# EAGLE design SimpleSAM (EAGLE 8.7.1)
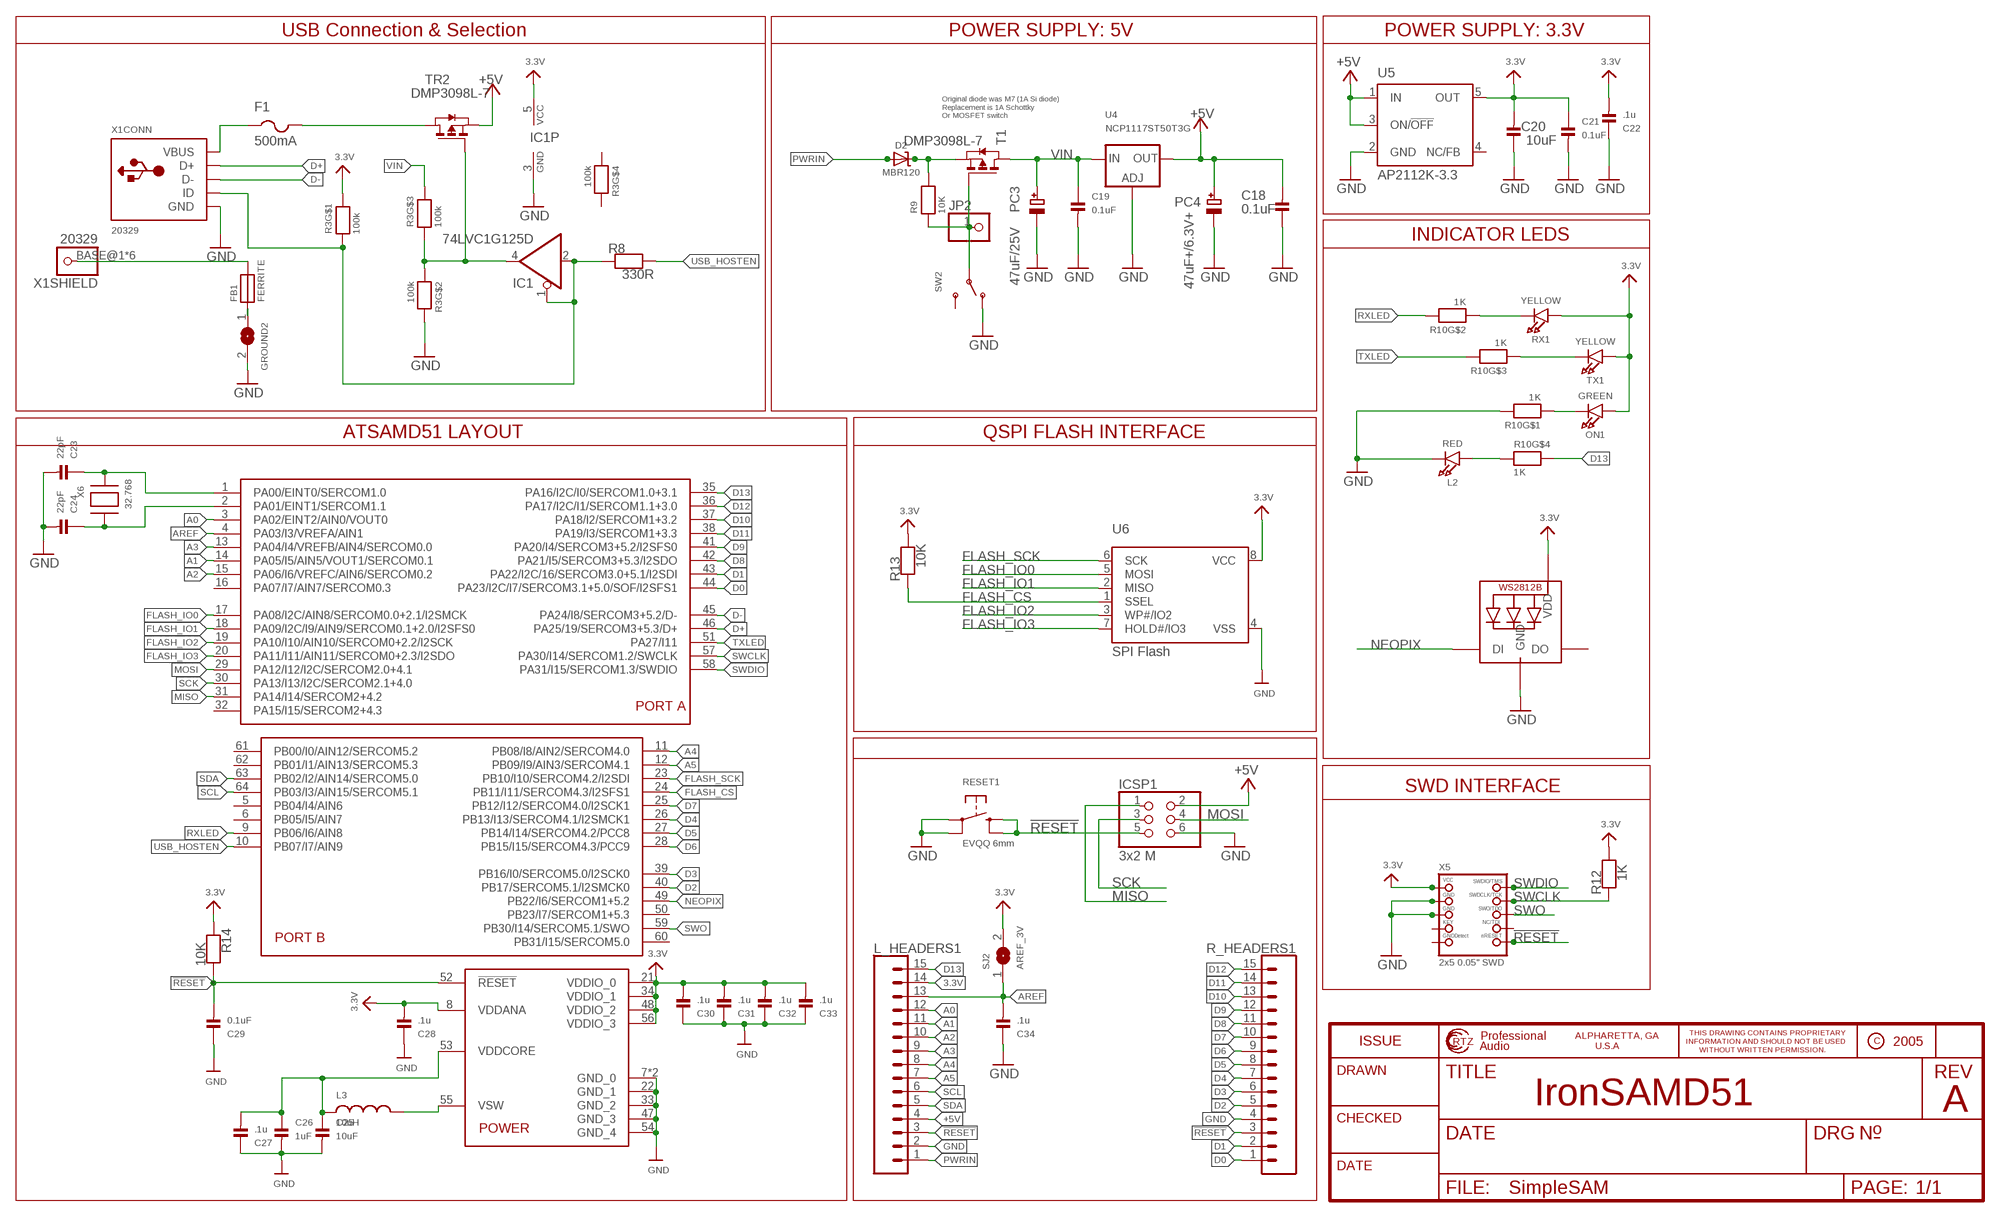
[diagram p0: schematic, sheet 1]

## Parts
C18  0.1uF  CAP_CERAMIC0805  [0805]
C19  0.1uF  CAP_CERAMIC0603  [0603]
C20  10uF  CAP_CERAMIC0805  [0805]
C21  0.1uF  CAP_CERAMIC0603  [0603]
C22  .1u  CAP_CERAMIC0603  [0603]
C23  22pF  CAP_CERAMIC0603  [0603]
C24  22pF  CAP_CERAMIC0603  [0603]
C25  10uF  CAP_CERAMIC0805  [0805]
C26  1uF  CAP_CERAMIC0603  [0603]
C27  .1u  CAP_CERAMIC0603  [0603]
C28  .1u  CAP_CERAMIC0603  [0603]
C29  0.1uF  CAP_CERAMIC0603  [0603]
C30  .1u  CAP_CERAMIC0603  [0603]
C31  .1u  CAP_CERAMIC0603  [0603]
C32  .1u  CAP_CERAMIC0603  [0603]
C33  .1u  CAP_CERAMIC0603  [0603]
C34  .1u  CAP_CERAMIC0603  [0603]
D2  MBR120  DIODE-SCHOTTKYSOD-123  [SOD-123]
F1  500mA  PTCFUSE-1206  [R1206]
FB1  FERRITE  [0603]
GROUND2  SOLDERJUMPERCLOSED  [SOLDERJUMPER_CLOSEDWIRE]
IC1  74LVC1G125D  74AHC1G125DBV  [SOT23-5]
ICSP1  3x2 M  HEADER-2X3  [2X03_ROUND_70MIL]
JP2  HEADER-1X1ROUND  [1X01_ROUND]
L2  RED  LED0805_NOOUTLINE  [CHIPLED_0805_NOOUTLINE]
L3  10uH  INDUCTOR  [INDUCTOR_1007]
L_HEADERS1  CONN_15  [1X15]
LED2  WS2812B3535  [LED3535]
ON1  GREEN  LED0805_NOOUTLINE  [CHIPLED_0805_NOOUTLINE]
PC3  47uF/25V  CAP_ELECTROLYTICPANASONIC_D  [PANASONIC_D]
PC4  47uF+/6.3V+  CAP_ELECTROLYTICPANASONIC_D  [PANASONIC_D]
R3  100k  RESISTOR_4PACK  [RESPACK_4X0603]
R8  330R  RESISTOR0603  [0603]
R9  10K  RESISTOR0603  [0603]
R10  1K  RESISTOR_4PACK  [RESPACK_4X0603]
R12  1K  RESISTOR0603  [0603]
R13  10K  RESISTOR0603  [0603]
R14  10K  RESISTOR0603  [0603]
R_HEADERS1  CONN_15  [1X15]
RESET1  EVQQ 6mm  SWITCH_TACT_SMT  [EVQ-Q2]
RX1  YELLOW  LED0805_NOOUTLINE  [CHIPLED_0805_NOOUTLINE]
SJ2  AREF_3V  SOLDERJUMPERCLOSED  [SOLDERJUMPER_CLOSEDWIRE]
SW2  SWITCH_SPDT  [SPDT_SMT_SSSS811101]
T1  DMP3098L-7  PMOSSOT23  [SOT-23]
TR2  DMP3098L-7  0297_PMV48XP  [SOT-23]
TX1  YELLOW  LED0805_NOOUTLINE  [CHIPLED_0805_NOOUTLINE]
U4  NCP1117ST50T3G  LM1117SOT223-REFLOW  [SOT223-R]
U5  AP2112K-3.3  LP2985-XXDBVR33  [SOT23-DBV]
U6  SPI Flash  SPIFLASH_SOIC8208MIL  [SOIC8_208MIL]
U$32  ATSAMD51J  [PQFN64-1]
X1  20329  USB_W_SHIELD_V2  [4UCONN_20329_V2]
X5  2x5 0.05" SWD  JTAG-CORTEXBOXPOSTS  [2X05_1.27MM_BOX_POSTS]
X6  32.768  XTAL-3.2X1.5  [XTAL3215]

## Nets
3.3V: C20.2 C21.1 C22.2 C28.2 C30.2 C31.2 C32.2 C33.2 IC1.5(VCC) L_HEADERS1.14 LED2.2(VDD) ON1.A R3.8 R14.1 RX1.A SJ2.2 TX1.A U5.5(OUT) U6.8(VCC) U$32.8(VDDANA) U$32.21(VDDIO_0) U$32.34(VDDIO_1) U$32.48(VDDIO_2) U$32.56(VDDIO_3) X5.1(VCC)
!RESET: C29.2 ICSP1.5 L_HEADERS1.3 R14.2 R_HEADERS1.3 RESET1.B'(S1) RESET1.B(S) U$32.52(!RESET) X5.10(NRESET)
+5V [usbvcc]: C18.2 ICSP1.2 L_HEADERS1.4 PC4.+ TR2.2(S) U4.2(OUT) U4.4(OUT) U5.1(IN) U5.3(ON/!OFF)
A0: L_HEADERS1.12 U$32.3(PA02/EINT2/AIN0/VOUT0)
A1: L_HEADERS1.11 U$32.14(PA05/I5/AIN5/VOUT1/SERCOM0.1)
A2: L_HEADERS1.10 U$32.15(PA06/I6/VREFC/AIN6/SERCOM0.2)
A3: L_HEADERS1.9 U$32.13(PA04/I4/VREFB/AIN4/SERCOM0.0)
A4: L_HEADERS1.8 U$32.11(PB08/I8/AIN2/SERCOM4.0)
A5: L_HEADERS1.7 U$32.12(PB09/I9/AIN3/SERCOM4.1)
AREF: C34.2 L_HEADERS1.13 SJ2.1 U$32.4(PA03/I3/VREFA/AIN1)
D0: R_HEADERS1.1 U$32.44(PA23/I2C/I7/SERCOM3.1+5.0/SOF/I2SFS1)
D1: R_HEADERS1.2 U$32.43(PA22/I2C/16/SERCOM3.0+5.1/I2SDI)
D2: R_HEADERS1.5 U$32.40(PB17/SERCOM5.1/I2SMCK0)
D3: R_HEADERS1.6 U$32.39(PB16/I0/SERCOM5.0/I2SCK0)
D4: R_HEADERS1.7 U$32.26(PB13/I13/SERCOM4.1/I2SMCK1)
D5: R_HEADERS1.8 U$32.27(PB14/I14/SERCOM4.2/PCC8)
D6: R_HEADERS1.9 U$32.28(PB15/I15/SERCOM4.3/PCC9)
D7: R_HEADERS1.10 U$32.25(PB12/I12/SERCOM4.0/I2SCK1)
D8: R_HEADERS1.11 U$32.42(PA21/I5/SERCOM3+5.3/I2SDO)
D9: R_HEADERS1.12 U$32.41(PA20/I4/SERCOM3+5.2/I2SFS0)
D10: R_HEADERS1.13 U$32.37(PA18/I2/SERCOM1+3.2)
D11: R_HEADERS1.14 U$32.38(PA19/I3/SERCOM1+3.3)
D12: R_HEADERS1.15 U$32.36(PA17/I2C/I1/SERCOM1.1+3.0)
D13: L_HEADERS1.15 R10.5 U$32.35(PA16/I2C/I0/SERCOM1.0+3.1)
D+: U$32.46(PA25/19/SERCOM3+5.3/D+) X1.D+(CONN:D+)
D-: U$32.45(PA24/I8/SERCOM3+5.2/D-) X1.D-(CONN:D-)
FLASH_CS: R13.1 U6.1(SSEL) U$32.24(PB11/I11/SERCOM4.3/I2SFS1)
FLASH_IO0: U6.5(MOSI) U$32.17(PA08/I2C/AIN8/SERCOM0.0+2.1/I2SMCK)
FLASH_IO1: U6.2(MISO) U$32.18(PA09/I2C/I9/AIN9/SERCOM0.1+2.0/I2SFS0)
FLASH_IO2: U6.3(WP#/IO2) U$32.19(PA10/I10/AIN10/SERCOM0+2.2/I2SCK)
FLASH_IO3: U6.7(HOLD#/IO3) U$32.20(PA11/I11/AIN11/SERCOM0+2.3/I2SDO)
FLASH_SCK: U6.6(SCK) U$32.23(PB10/I10/SERCOM4.2/I2SDI)
GND: C18.1 C19.2 C20.1 C21.2 C22.1 C23.2 C24.2 C25.2 C26.2 C27.1 C29.1 C30.1 C31.1 C32.1 C33.1 C34.1 GROUND2.2 IC1.3(GND) ICSP1.6 L2.C L_HEADERS1.2 LED2.4(GND) PC3.- PC4.- R3.7 R10.8 R_HEADERS1.4 RESET1.A'(P1) RESET1.A(P) SW2.A(O) U4.1(ADJ) U5.2(GND) U6.4(VSS) U$32.7(GND_0) U$32.22(GND_1) U$32.33(GND_2) U$32.47(GND_3) U$32.54(GND_4) U$32.EXP(GND_0) X1.GND(CONN:GND) X5.3(GND) X5.5(GND)
MISO: ICSP1.1 U$32.31(PA14/I14/SERCOM2+4.2)
MOSI: ICSP1.4 U$32.29(PA12/I12/I2C/SERCOM2.0+4.1)
N$2: F1.1 X1.VBUS(CONN:VBUS)
N$16: F1.2 TR2.1(D)
N$17: IC1.4(O) R3.2 R3.3 TR2.3(G)
N$18: FB1.1 GROUND2.1
N$19: D2.C R9.2 T1.2(S)
N$20: R10.2 RX1.C
N$21: R10.3 TX1.C
N$22: L2.A R10.4
N$23: C23.1 U$32.1(PA00/EINT0/SERCOM1.0) X6.P$1
N$24: C24.1 U$32.2(PA01/EINT1/SERCOM1.1) X6.P$2
N$25: L3.P$2 U$32.55(VSW)
N$26: C25.1 C26.1 C27.2 L3.P$1 U$32.53(VDDCORE)
N$27: ON1.C R10.1
N$28: IC1.1(OE) IC1.2(I) R3.1 R8.1 X1.ID(CONN:ID)
NEOPIX: LED2.1(DI) U$32.49(PB22/I6/SERCOM1+5.2)
PWR_SWITCH1: JP2.1 R9.1 SW2.B(P) T1.3(G)
PWRIN [USB]: D2.A L_HEADERS1.1
RXLED: R10.7 U$32.9(PB06/I6/AIN8)
SCK: ICSP1.3 U$32.30(PA13/I13/I2C/SERCOM2.1+4.0)
SCL: L_HEADERS1.6 U$32.64(PB03/I3/AIN15/SERCOM5.1)
SDA: L_HEADERS1.5 U$32.63(PB02/I2/AIN14/SERCOM5.0)
SWCLK: R12.1 U$32.57(PA30/I14/SERCOM1.2/SWCLK) X5.4(SWDCLK)
SWDIO: U$32.58(PA31/I15/SERCOM1.3/SWDIO) X5.2(SWDIO)
SWO: U$32.59(PB30/I14/SERCOM5.1/SWO) X5.6(SWO)
TXLED: R10.6 U$32.51(PA27/I11)
USB_HOSTEN: R8.2 U$32.10(PB07/I7/AIN9)
USHIELD1 [gnd]: FB1.2 X1.BASE@1 X1.BASE@2 X1.SPRT@1 X1.SPRT@2 X1.SPRT@3 X1.SPRT@4
VIN: C19.1 PC3.+ R3.6 T1.1(D) U4.3(IN)
Unconnected: C28.1 LED2.3(DO) R3.4 R3.5 R12.2 R13.2 SW2.C(S) U5.4(NC/FB) U$32.5(PB04/I4/AIN6) U$32.6(PB05/I5/AIN7) U$32.16(PA07/I7/AIN7/SERCOM0.3) U$32.32(PA15/I15/SERCOM2+4.3) U$32.50(PB23/I7/SERCOM1+5.3) U$32.60(PB31/I15/SERCOM5.0) U$32.61(PB00/I0/AIN12/SERCOM5.2) U$32.62(PB01/I1/AIN13/SERCOM5.3) X5.7(KEY) X5.8(TDI) X5.9(GNDDETECT)

## Notes on the sheet
- USB Connection & Selection | POWER SUPPLY: 5V | POWER SUPPLY: 3.3V
- Original diode was M7 (1A Si diode)
  Replacement is 1A Schottky
  Or MOSFET switch
- INDICATOR LEDS
- ATSAMD51 LAYOUT | QSPI FLASH INTERFACE
- SWD INTERFACE
- IronSAMD51 | A

## Library data of the parts
C18-C34 = microbuilder:CAP_CERAMIC: Ceramic Capacitors 0402 - 0402 Surface Mount Capacitors 16pF 50V 5% [Digikey: 445-4899-2-ND] 18pF 50V 5% [Digikey: 490-1281-2-ND] 22pF 50V 5% [Digikey: 490-1283-2-ND] 68pF 50V 5% [Digikey: 490-1289-2-ND] 0.1uF 10V 10% [Digikey: 490-1318-2-ND] 1.0uF 6.3V 10% [Digikey: 490-1320-2-ND] 0603 - 0603 Surface Mount Capacitors 16 pF 50V 5% [Digikey: 445-5051-2-ND] 22 pF 50V [Digikey: PCC220ACVTR-ND] 33 pF 50V 5% [Digikey: 490-1415-1-ND] 56pF 50V 5% [Digikey: 490-1421-1-ND] 220pF 50V 5% [Digikey: 445-1285-1-ND] 680 pF 50V 2200 pF 50V 5% C0G [Digikey: 445-1297-1-ND] 5600 pF 100V 5% X7R [Digikey: 478-3711-1-ND] 0.1 µF 25V 10% [Digikey: PCC2277TR-ND] 0.22 µF 16V 10% X7R [Digikey: 445-1318-1-ND] 1.0 µF 25V 10% [Digikey: 445-5146-2-ND] 0603 - RF Specific 3pF 250V +/-0.1pF RF [Digikey: 712-1347-1-ND] 18 pF 250V 5% [Digikey: 478-3505-1-ND or 712-1322-1-ND] 56 pF 250V 5% C0G RF [Digikey: 490-4867-1-ND] 68 pF 250V RF [Digikey: 490-4868-1-ND] 0805 - 0805 Surface Mount Capacitors 220 pF 250V 2% RF Ceramic Capacitor [Digikey: 712-1398-1-ND] 1000 pF 50V 2% NP0 Ceramic Capacitor [Digikey: 478-3760-1-ND] 0.1 µF 25V 10% Ceramic Capacitor [Digikey: PCC1828TR-ND] 1.0 µF 16V 10% Ceramic Capacitor[Digikey: 490-1691-2-ND] 10.0 µF 10V 10% Ceramic Capacitor[Digikey: 709-1228-1-ND] 10.0 uF 16V 10% Ceramic Capacitor [Digikey: 478-5165-2-ND] 47 uF 6.3V 20% Ceramic Capacitor [Digikey: 587-1779-1-ND or 399-5506-1-ND] 1206 - 1206 Surface Mount Capacitors 47uF 10V 20% Ceramic Capacitor [Digikey: 490-5528-1-ND or 399-5508-1-ND or 445-6010-1-ND]
D2 = microbuilder:DIODE-SCHOTTKY
F1 = adafruit:PTCFUSE: PTC fuses, resettable thermistors
FB1 = microbuilder:FERRITE: Ferrite Bead 0603 MMZ1608B121C - 120 Ohm, 600mA Ferrite Chip - Digikey: 445-2164-1-ND BK1608HW121-T - 120 Ohm, 600mA Ferrite Chip - Digikey: 587-1876-2-ND
GROUND2 SJ2 = microbuilder:SOLDERJUMPER: SMD Solder JUMPER Solder the two pads together to create a connection, or remove the solder to break it. REFLOW - Use this footprint for solder paste and reflow ovens. WAVE - Use this footprint for hand-soldering (larger pads). CLOSED - Has a trace between the two pads to ensure it is closed by default. The trace needs to be cut to disable the jumper, and can be closed again by creating a solder bridge between the two pads.
IC1 = 74xx-little-de:74*1G125: Single Bus Buffer Gate with 3-State Output
ICSP1 = microbuilder:HEADER-2X3: PIN HEADER
JP2 = microbuilder:HEADER-1X1: PIN HEADER
L2 ON1 RX1 TX1 = microbuilder:LED: LED 0603 - 0603 Surface Mount Package 2mA: Green LED - Low Power (3.9mcd, 2ma, 1.7Vf) - Digikey: 475-2709-2-ND Orange LED - Low Power (9.8mcd, 2ma, 1.8Vf) - Digikey: 475-1194-2-ND Red LED - Low Power (5mcd, 2ma, 1.8Vf) - Digikey: 475-1195-2-ND Yellow LED - Low Power (7mcd, 2ma, 1.8Vf) - Digikey: 475-1196-2-ND 5mA: Blue LED - Low Power (17mcd, 5ma, 2.9Vf) - Digikey: LNJ937W8CRACT-ND 0805 - 0805 Surface Mount Package 2mA: Red LED (8.8mcd, 2mA, 1.8Vf, Clear) - Low Power [Digikey: 475-2510-1-ND] Green LED (5mcd, 2mA, 1.8Vf, Clear) - Low Power [Digikey: 475-2730-1-ND] Yellow LED (11.3mcd, 2mA, 1.8Vf, Clear) - Low Power [Digikey: 475-2555-1-ND] 20mA: Red LED (104mcd, 20mA, Diffused) - LS R976 [Digikey: 475-1278-6-ND] Red LED (12mcd, 20mA, 2.0Vf, Clear) - APT2012EC [Digikey: 754-1128-1-ND] Green LED (15mcd, 20mA, 2.2Vf, Clear) - APT2012GC [Digikey: 754-1131-1-ND] Orange LED (160mcd, 20mA, 2.1Vf, Clear) - APT2012SECK [Digikey: 754-1130-1-ND] 1206 - 1206 Surface Mount Package Green LED (26mcd, 20mA, Diffused) - LG N971 [Digikey: 475-1407-6-ND] Red LED (15mcd, 20mA, Diffused) - LH N974 [Digikey: 475-1416-6-ND] Cree - Cree High-Power Surface Mount LEDs XPEBWT-L1-0000-00D50 - White 111lm 350mA 2.9Vf 6200K 110° XTEAWT-00-0000-00000LEE3 - White 114lm 350mA 2.85Vf 5000K 115° Everlight - Everlight 45-21 Series Surface Mount LEDs 45-21/QK2C-B2832AC2CB2/2T - Warm White 2000mcd 20mA 3.25Vf 3050K 120° 45-21/LK2C-B38452C4CB2/2T - Nuetral White 2000mcd 20mA 3.25Vf 4150K 120° 45-21/LK2C-B50634C6CB2/2T - Cold White 2200mcd 20mA 3.25Vf 5650K 120° PLCC2 Reverse Mount LS T77K-J1L2-1-0-2-R18-Z - Red 11.25mcd 2mA 1.8Vf 630nm 120° LO T77K-L1M2-24-Z - Orange 19.6mcd 2mA 1.8Vf 606nm 120° LY T77K-K2M1-26-Z - Yellow 15.7mcd 2mA 1.8Vf 587nm 120°
L3 = microbuilder:INDUCTOR: Inductors 0603: 10nH Ceramic Inductor - microwire antenna/RF (Digikey: 712-1434-2-ND) 0805: 560nH Ceramic Inductor - RF (Digikey: 553-1047-1-ND) 1007 (2518 Metric) SMT: 10µH 10% 250mOhm 820mA 1007 Inductor (Digikey: 587-2189-1-ND) 22µH 10% 500mOhm 580mA 1007 Inductor (Digikey: 587-2190-1-ND) 47µH 10% 950mOhm 420mA 1007 Inductor (Digikey: 587-2191-1-ND) 47µH 5% 100mOhm 1A 1008 Inductor (Digikey: 732-1816-1-ND) 6.0x6.0mm: 4.7µH 20% 3.8A 27mOhm Inductor (Digikey: 445-6538-2-ND)
L_HEADERS1 R_HEADERS1 = SparkFun-Connectors:CONN_15: Multi connection point. Often used as Generic Header-pin footprint for 0.1 inch spaced/style header connections On any of the 0.1 inch spaced packages, you can populate with these: Break Away Headers - Straight <https://www.sparkfun.com/products/116> (PRT-00116) Break Away Male Headers - Right Angle <https://www.sparkfun.com/products/553> (PRT-00553) Female Headers <https://www.sparkfun.com/products/115> (PRT-00115) Break Away Headers - Machine Pin <https://www.sparkfun.com/products/117> (PRT-00117) Break Away Female Headers - Swiss Machine Pin <https://www.sparkfun.com/products/743> (PRT-00743) For SCREWTERMINALS and SPRING TERMINALS visit here: Screw Terimnals on SparkFun.com <https://www.sparkfun.com/search/results?term=Screw+Terminals> (5mm/3.5mm/2.54mm spacing) This device is also useful as a general connection point to wire up your design to another part of your project. Our various solder wires solder well into these plated through hole pads. Hook-Up Wire - Assortment (Stranded, 22 AWG) <https://www.sparkfun.com/products/11375> (PRT-11375) Hook-Up Wire - Assortment (Solid Core, 22 AWG) <https://www.sparkfun.com/products/11367> (PRT-11367) View the entire wire category on our website here <https://www.sparkfun.com/categories/141> Special notes: Molex polarized connector foot print use with SKU : PRT-08231 with associated crimp pins and housings. 1MM SMD Version SKU: PRT-10208 NOTES ON THE VARIANTS LOCK and LOCK_LONGPADS... This footprint was designed to help hold the alignment of a through-hole component (i.e. 6-pin header) while soldering it into place. You may notice that each hole has been shifted either up or down by 0.005 of an inch from it's more standard position (which is a perfectly straight line). This slight alteration caused the pins (the squares in the middle) to touch the edges of the holes. Because they are alternating, it causes a "brace" to hold the component in place. 0.005 has proven to be the perfect amount of "off-center" position when using our standard breakaway headers. Although looks a little odd when you look at the bare footprint, once you have a header in there, the alteration is very hard to notice. Also,if you push a header all the way into place, it is covered up entirely on the bottom side.
LED2 = microbuilder:WS2812B
PC3 PC4 = microbuilder:CAP_ELECTROLYTIC: Electrolytic Capacitors SMT PANASONIC_C - Size C Panasonic Electrolytic Aluminum Capacitor 47µF 16V 20% Electrolytic Capacitor [Digikey: PCE3890TR-ND] PANASONIC_D - Size D Panasonic Electrolytic Aluminum Capacitor 100µF 25V 20% Electrolytic Capacitor [Digikey: PCE3898TR-ND] PTH 3.5 mm grid, 8 mm diameter ... 3.5 mm grid, 10 mm diameter ...
R3 R10 = microbuilder:RESISTOR_4PACK: Resistor Packs (4 resistors) 4 x 0603 10K 1/16W - Digikey: YC164J-10KCT-ND
R8 R9 R12-R14 = microbuilder:RESISTOR: Resistors 0402 - 0402 Surface Mount Package 22 Ohm 1% 1/16W [Digikey: 311-22.0LRTR-ND] 33 Ohm 5% 1/16W 1.0K 5% 1/16W 1.5K 5% 1/16W 2.0K 1% 1/16W 10.0K 1% 1/16W [Digikey: 311-10.0KLRTR-ND] 10.0K 5% 1/16W [Digikey: RMCF0402JT10K0TR-ND] 12.1K 1% 1/16W [Digikey: 311-22.0LRTR-ND] 100.0K 5% 1/16W 0603 - 0603 Surface Mount Package 0 Ohm 1/10 Watt 1% Resistor 15 Ohm 1/10 Watt 1% Resistor 33 Ohm 1/10 Watt 1% Resistor 49.9 Ohm 1/10 Watt 1% Resistor 100 Ohm 1/10 Watt 1% Resistor 150 Ohm 1/10 Watt 1% Resistor 240 Ohm 1/10 Watt 1% Resistor 390 Ohm 1/10 Watt 1% Resistor 560 Ohm 1/10 Watt 1% Resistor 680 Ohm 1/10 Watt 1% Resistor 750 Ohm 1/10 Watt 1% Resistor 1.0K Ohm 1/10 Watt 1% Resistor 1.5K Ohm 1/10 Watt 1% Resistor 2.0K Ohm 1/10 Watt 1% Resistor 2.2K Ohm 1/10 Watt 1% Resistor 3.3K Ohm 1/10 Watt 1% Resistor 4.7K Ohm 1/10 Watt 1% Resistor 10.0K Ohm 1/10 Watt 1% Resistor 12.0K Ohm 1/10 Watt 1% Resistor 12.1K Ohm 1/10 Watt 1% Resistor 20.0K Ohm 1/10 Watt 1% Resistor 33.0K Ohm 1/10 Watt 1% Resistor 100.0K Ohm 1/10 Watt 1% Resistor 0805 - 0805 Surface Mount Package 0 Ohm 1/8 Watt 1% Resistor 33 Ohm 1/8 Watt 1% Resistor 100 Ohm 1/8 Watt 1% Resistor 150 Ohm 1/8 Watt 1% Resistor 200 Ohm 1/8 Watt 1% Resistor 240 Ohm 1/8 Watt 1% Resistor 330 Ohm 1/8 Watt 1% Resistor 390 Ohm 1/8 Watt 1% Resistor 470 Ohm 1/8 Watt 1% Resistor 1.0K Ohm 1/8 Watt 1% Resistor 1.5K Ohm 1/8 Watt 1% Resistor 2.0K Ohm 1/8 Watt 1% Resistor 4.7K Ohm 1/8 Watt 1% Resistor 5.1K Ohm 1/8 Watt 1% Resistor 5.6K Ohm 1/8 Watt 1% Resistor 10.0K Ohm 1/8 Watt 1% Resistor 22.0K Ohm 1/8 Watt 1% Resistor 33.0K Ohm 1/8 Watt 1% Resistor 100K Ohm 1/8 Watt 1% Resistor 1206 - 1206 Surface Mount Package 2012 - 2010 Surface Mount Package 0.11 Ohm 1/2 Watt 1% Resistor - Digikey: RHM.11UCT-ND
RESET1 = microbuilder:SWITCH_TACT_SMT: SMT Tact Switches 6x6mm - Digikey: P12940SCT-ND KMR2 (4.6x2.8mm) - Digikey: 401-1426-1-ND EVQ-PQHB55 - Light Touch, 160GF (4.5x4.5mm) - Digikey: P8090SCT-ND KMT0 - KMT021 NGJ LHS (etc.) IP68/Waterproof - Digikey: CKN10289CT-ND
SW2 = microbuilder:SWITCH_SPDT: Switch - SPDT SSSS811101 - Horizontal Two Position SMT, 0.3A 4V [Mouser: 688-SSSS811101]
T1 = zetex:PMOSSOT23: MOS FET; OC_FARNELL: unknown; OC_NEWARK: unknown
TR2 = Transistors:0297_PMV48XP: 20 V, 3.5 A P-channel Trench MOSFET - PMV48XP; CASE: SOT23; MONTHLY_USAGE: _____; PART_NUMBER: PMV48XP; PRICE: _____; SUPPLIER: _____; TYPE: Transistor; VALUE: PMV48XP
U4 = microbuilder:LM1117: LM1117 Voltage Regulator LM1117 Adjustable Voltage regulator [Digikey: LM1117IMP-ADJDKR-ND] LM1117 3.3V Voltage regulator [AP1117E33GDIDKR-ND] LM1117 5.0V Voltage regulator [AP1117E50GDIDKR-ND] SOT223-REFLOW - SOT223 package for solder paste/reflow ovens SOT223-WAVE - SOT223 package for hand-soldering (larger pads) Note: For the fixed-voltage regulators, simply set the ADJ pin to GND.
U5 = SmartPrj:LP2985-XXDBVR: ULTRALOW-POWER 50-mA LOW-DROPOUT LINEAR REGULATORS 50-mA Low-Dropout Regulator Source: http://focus.ti.com/lit/ds/symlink/tps77001.pdf
U6 = microbuilder:SPIFLASH_SOIC8: SOIC8 SPI Flash Be careful with the size since SOIC8 flash comes in several 'widths' SOIC8 150 mil M25P16 - 16Mbit (2Mbit x 8) Serial Flash (75MHz SPI Bus), Supply: 2.7-3.6V Digikey: SOIC8 - M25P16-VMN6P-ND SOIC8 208 mil W25Q16BVSSIG - 16Mbit (2Mbit x 8) Serial Flash (104MHz SPI Bus), Supply: 2.7-3.6V Digikey: SOIC8 - W25Q16BVSSIG-ND
U$32 = microbuilder:ATSAMD51J: ATSAMD51J cortex m4 microcontroller
X1 = microbuilder:USB_W_SHIELD
X5 = microbuilder:JTAG-CORTEX: Serial Wire (SW-DP) Connector Standard 0.05" 10-pin connector is for use with the Cortex M and Cortex A SWD (serial wire debugger) interface (SW-DP) Connectors 2x05_1.27MM_SMT - Inexpensive surface-mount header with bare pins, compatible with standard 10-pin SWD cables (4UCON: 16846) 2x05_1.27MM_BOX_NOPOSTS - Polarised surface-mount box (4UCON with caps: 19735, without caps: 15117 2x05_1.27MM_BOX_POSTS - Polarised surface-mount box with mounting holes (4UCON: 20317) Pinout: http://infocenter.arm.com/help/topic/com.arm.doc.faqs/attached/13634/cortex_debug_connectors.pdf http://www.keil.com/peripherals/coresight/connectors.asp
X6 = adafruit2:XTAL: Low cost SMT crystals, no capacitors included http://www.ladyada.net/library/eagle

## Board
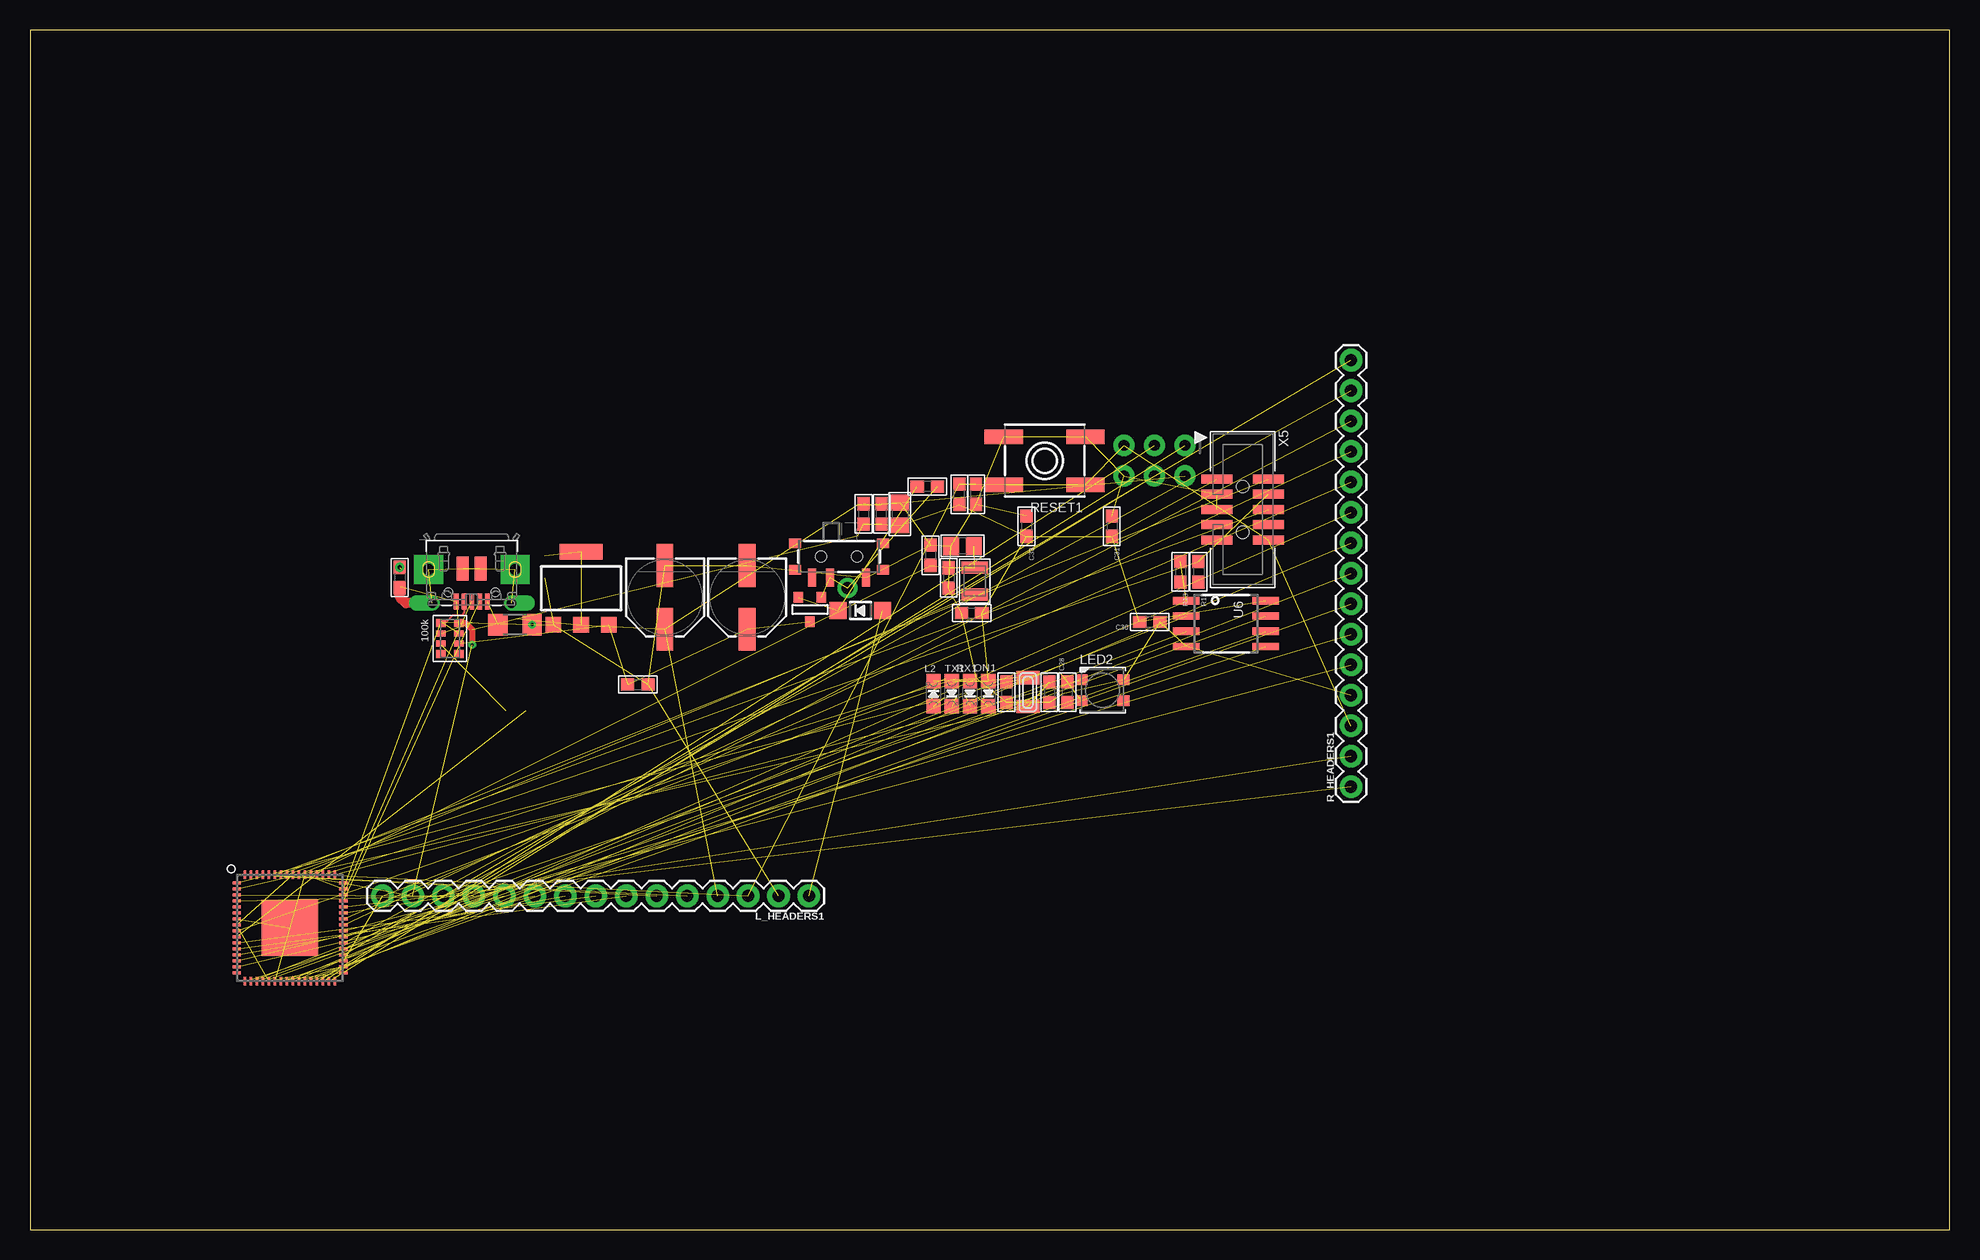
[diagram p1: board, top side]
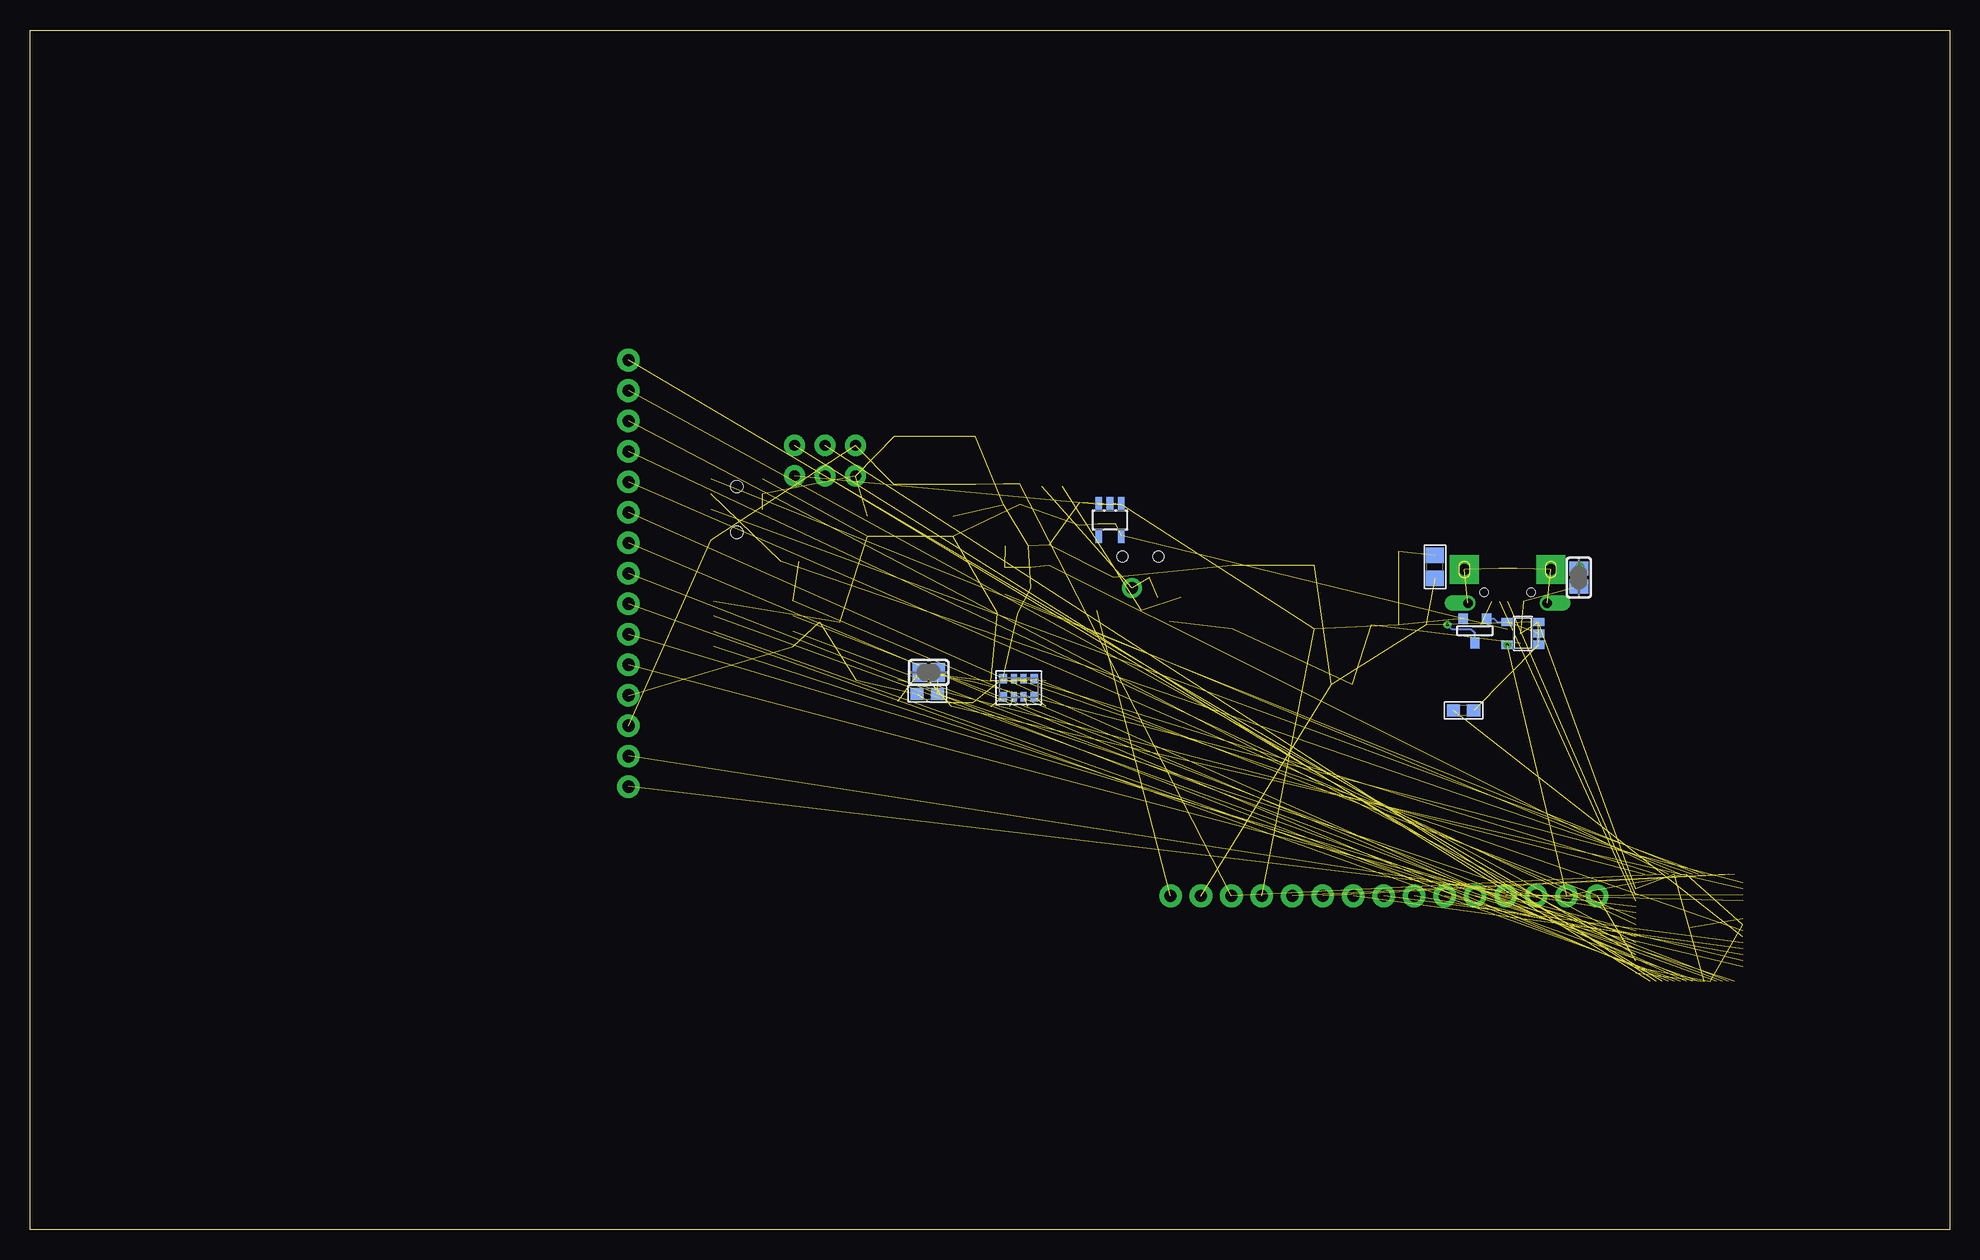
[diagram p2: board, bottom side, seen from below]

Size 160 x 100 mm. Coordinates in mm from the lower left corner, seen from the top.
Outline: 0,0 160,0 160,100 0,100 0,0
Copper layers (1*16): Top 0.035mm / dielectric 1.5mm / Bottom 0.035mm
Design rules "default": minimum track width 6mil, minimum drill 0.35mm, track to track 6mil, track to pad 6mil, pad to pad 6mil, via to via 6mil, smd to smd 6mil, copper to edge 40mil, drill to drill 6mil, minimum pad ring 10mil, minimum via ring 8mil, stop-mask expansion 4mil, vias tented up to drill 0mil, thermal gap 10mil

### Footprints (pad centres in the part's own frame; a part is rotated, then mirrored left to right if it is on the bottom)
0805 = smd 1.3 x 1.5: 1 -0.95,0; 2 0.95,0
0603 = smd 1.1 x 1: 1 -0.85,0; 2 0.85,0
SOD-123 = smd 1.4 x 1.4: A 1.85,0; C -1.85,0
R1206 = smd 1.6 x 1.803: 1 -1.422,0; 2 1.422,0
SOLDERJUMPER_CLOSEDWIRE = smd 1.168 x 1.6: 1 -0.762,0; 2 0.762,0 | smd 0.635 x 0.203: WIRE 0,0
SOT23-5 = smd 0.69 x 0.99: 1 -0.95,-1.29; 2 0,-1.29; 3 0.95,-1.29; 4 0.95,1.3; 5 -0.95,1.3
2X03_ROUND_70MIL = drill 0.9 pad 1.778: 1 -2.54,-1.27; 2 -2.54,1.27; 3 0,-1.27; 4 0,1.27; 5 2.54,-1.27; 6 2.54,1.27
1X01_ROUND = drill 1 pad 1.676: 1 0,0
CHIPLED_0805_NOOUTLINE = smd 1.2 x 1.2: A 0,-1.05; C 0,1.05
INDUCTOR_1007 = smd 1.016 x 2.2: P$1 -1.127,0; P$2 1.127,0
1X15 = drill 1.016 pad 1.88: 1 0,0; 2 2.54,0; 3 5.08,0; 4 7.62,0; 5 10.16,0; 6 12.7,0; 7 15.24,0; 8 17.78,0; 9 20.32,0; 10 22.86,0; 11 25.4,0; 12 27.94,0; 13 30.48,0; 14 33.02,0; 15 35.56,0
LED3535 = smd 1 x 0.85: 1 -1.75,0.875; 2 -1.75,-0.875; 3 1.75,-0.875; 4 1.75,0.875
PANASONIC_D = smd 3.556 x 1.4: + 2.654,0; - -2.654,0
RESPACK_4X0603 = smd 0.65 x 0.8: 1 -1.3,-0.75; 4 1.3,-0.75; 5 1.3,0.75; 8 -1.3,0.75 | smd 0.5 x 0.8: 2 -0.4,-0.75; 3 0.4,-0.75; 6 0.4,0.75; 7 -0.4,0.75
EVQ-Q2 = smd 3.2 x 1.2: A -3.4,-2; A' 3.4,-2; B -3.4,2; B' 3.4,2
SPDT_SMT_SSSS811101 = smd 0.7 x 1.5: A -2.25,1.75; B 0.75,1.75; C 2.25,1.75 | smd 1 x 0.8: SUP1 -3.65,1.1; SUP2 -3.65,-1.1; SUP3 3.65,1.1; SUP4 3.65,-1.1 | hole 0.9: -1.5,0; 1.5,0
SOT-23 = smd 0.787 x 0.889: 1 0.025,-1.016; 2 -0.94,1.016; 3 0.991,1.016
SOT223-R = smd 1.3 x 1.3: 1 -2.3,-3.05; 2 0,-3.05; 3 2.3,-3.05 | smd 3.6 x 1.3: 4 0,3.05
SOT23-DBV = smd 0.55 x 1.2: 1 -0.95,-1.3; 2 0,-1.3; 3 0.95,-1.3; 4 0.95,1.3; 5 -0.95,1.3
SOIC8_208MIL = smd 0.6 x 2.2: 1 -1.905,-3.315; 2 -0.635,-3.315; 3 0.635,-3.315; 4 1.905,-3.315; 5 1.905,3.315; 6 0.635,3.315; 7 -0.635,3.315; 8 -1.905,3.315
PQFN64-1 = smd 0.7 x 0.22: 1 -4.45,3.75; 2 -4.45,3.25; 3 -4.45,2.75; 4 -4.45,2.25; 5 -4.45,1.75; 6 -4.45,1.25; 7 -4.45,0.75; 8 -4.45,0.25; 9 -4.45,-0.25; 10 -4.45,-0.75; 11 -4.45,-1.25; 12 -4.45,-1.75; 13 -4.45,-2.25; 14 -4.45,-2.75; 15 -4.45,-3.25; 16 -4.45,-3.75; 33 4.45,-3.75; 34 4.45,-3.25; 35 4.45,-2.75; 36 4.45,-2.25; 37 4.45,-1.75; 38 4.45,-1.25; 39 4.45,-0.75; 40 4.45,-0.25; 41 4.45,0.25; 42 4.45,0.75; 43 4.45,1.25; 44 4.45,1.75; 45 4.45,2.25; 46 4.45,2.75; 47 4.45,3.25; 48 4.45,3.75 | smd 0.22 x 0.7: 17 -3.75,-4.45; 18 -3.25,-4.45; 19 -2.75,-4.45; 20 -2.25,-4.45; 21 -1.75,-4.45; 22 -1.25,-4.45; 23 -0.75,-4.45; 24 -0.25,-4.45; 25 0.25,-4.45; 26 0.75,-4.45; 27 1.25,-4.45; 28 1.75,-4.45; 29 2.25,-4.45; 30 2.75,-4.45; 31 3.25,-4.45; 32 3.75,-4.45; 49 3.75,4.45; 50 3.25,4.45; 51 2.75,4.45; 52 2.25,4.45; 53 1.75,4.45; 54 1.25,4.45; 55 0.75,4.45; 56 0.25,4.45; 57 -0.25,4.45; 58 -0.75,4.45; 59 -1.25,4.45; 60 -1.75,4.45; 61 -2.25,4.45; 62 -2.75,4.45; 63 -3.25,4.45; 64 -3.75,4.45 | smd 4.7 x 4.7: EXP 0,0
4UCONN_20329_V2 = smd 1 x 2: BASE@1 -0.75,-2; BASE@2 0.75,-2 | smd 0.4 x 1.35: D+ 0,0.775; D- -0.65,0.775; GND 1.3,0.775; ID 0.65,0.775; VBUS -1.3,0.775 | drill 0.8 pad 1.143 offset: SPRT@1 -3.3,0.9; SPRT@2 3.3,0.9 | drill 0.9 pad 2.413 square: SPRT@3 -3.6,-1.9; SPRT@4 3.6,-1.9 | hole 0.7: -1.95,0; 1.95,0
2X05_1.27MM_BOX_POSTS = smd 0.76 x 2.6: 1 -2.54,-2.15; 2 -2.54,2.15; 3 -1.27,-2.15; 4 -1.27,2.15; 5 0,-2.15; 6 0,2.15; 7 1.27,-2.15; 8 1.27,2.15; 9 2.54,-2.15; 10 2.54,2.15 | hole 1: -1.905,0; 1.905,0
XTAL3215 = smd 1.1 x 1.9: P$1 1.2,0; P$2 -1.2,0

### Placement (x,y rotation side)
C18  42.89,55.24 90 bottom
C19  50.67,45.43 0 top
C20  72.52,59.65 270 top
C21  70.99,59.65 90 top
C22  69.47,59.65 270 top
C23  81.41,44.79 270 top
C24  84.96,44.79 270 top
C25  77.72,56.98 180 top
C26  76.58,54.32 270 top
C27  75.06,56.22 270 top
C28  86.49,44.79 90 top
C29  78.87,61.3 90 top
C30  93.34,50.63 180 top
C31  90.17,58.64 270 top
C32  78.48,51.4 0 top
C33  83.06,58.64 270 top
C34  85.22,44.67 0 bottom
D2  69.22,51.6 0 top
F1  40.42,50.42 0 top
FB1  30.82,54.36 270 top
GROUND2  30.9,54.35 270 bottom
IC1  35.56,49.7 90 bottom
ICSP1  93.72,64.1 180 top
JP2  68.16,53.47 270 top
L2  75.31,44.67 0 top
L3  78.74,54.06 270 top
L_HEADERS1  64.94,27.81 180 top
LED2  89.41,44.96 0 top
ON1  79.88,44.67 180 top
PC3  59.78,52.71 270 top
PC4  52.92,52.71 270 top
R3  35.01,49.27 270 top
R8  40.51,43.27 180 bottom
R9  74.8,61.94 180 top
R10  77.6,45.17 0 bottom
R12  97.41,54.83 270 top
R13  95.88,54.83 270 top
R14  77.47,61.3 90 top
R_HEADERS1  110.11,36.92 90 top
RESET1  84.58,64.1 180 top
RX1  78.36,44.67 180 top
SJ2  85.09,46.44 180 bottom
SW2  67.44,56.1 180 top
T1  64.99,51.69 0 top
TR2  39.59,49.91 0 bottom
TX1  76.83,44.67 180 top
U4  45.94,53.47 0 top
U5  69.98,59.14 180 bottom
U6  99.69,50.51 270 top
U$32  21.68,25.15 0 top
X1  36.83,53.12 180 top
X5  101.09,60.03 270 top
X6  83.18,44.79 90 top

### Tracks (layer width: path | path; a pad name or v marks a point on that pad's centre or on a via)
3.3V  (via drill 0.25)  (23 unrouted)
  Top 0.508: R3.8 36.29,50.58 36.86,50.01 IC1.5
  other vias: 36.86,48.74
!RESET  (8 unrouted)
+5V  (8 unrouted)
A0  (1 unrouted)
A1  (1 unrouted)
A2  (1 unrouted)
A3  (1 unrouted)
A4  (1 unrouted)
A5  (1 unrouted)
AREF  (3 unrouted)
D0  (1 unrouted)
D1  (1 unrouted)
D2  (1 unrouted)
D3  (1 unrouted)
D4  (1 unrouted)
D5  (1 unrouted)
D6  (1 unrouted)
D7  (1 unrouted)
D8  (1 unrouted)
D9  (1 unrouted)
D10  (1 unrouted)
D11  (1 unrouted)
D12  (1 unrouted)
D13  (2 unrouted)
D+  (1 unrouted)
D-  (1 unrouted)
FLASH_CS  (2 unrouted)
FLASH_IO0  (1 unrouted)
FLASH_IO1  (1 unrouted)
FLASH_IO2  (1 unrouted)
FLASH_IO3  (1 unrouted)
FLASH_SCK  (1 unrouted)
GND  (41 unrouted)
MISO  (1 unrouted)
MOSI  (1 unrouted)
N$2  (1 unrouted)
N$16  (via drill 0.25)
  Bottom 0.152: TR2.1 39.56,49.72 39.88,50.04 41.47,50.04 F1.2
  other vias: 41.85,50.42
N$17  (2 unrouted)
  Bottom 0.152: TR2.3 37.97,50.93 37.69,50.65 IC1.4
N$18  (via drill 0.35)  (1 unrouted)
  other vias: 30.82,55.21
N$19  (2 unrouted)
N$20  (1 unrouted)
N$21  (1 unrouted)
N$22  (1 unrouted)
N$23  (2 unrouted)
N$24  (2 unrouted)
N$25  (1 unrouted)
N$26  (4 unrouted)
N$27  (1 unrouted)
N$28  (2 unrouted)
  Top 0.152: X1.ID 36.18,51.42 35.97,51.2 35.24,51.2 34.61,50.58 R3.1
  Bottom 0.305: IC1.2 IC1.1
NEOPIX  (1 unrouted)
PWR_SWITCH1  (3 unrouted)
PWRIN  (1 unrouted)
RXLED  (1 unrouted)
SCK  (1 unrouted)
SCL  (1 unrouted)
SDA  (1 unrouted)
SWCLK  (2 unrouted)
SWDIO  (1 unrouted)
SWO  (1 unrouted)
TXLED  (1 unrouted)
USB_HOSTEN  (1 unrouted)
USHIELD1  (5 unrouted)
  Top 0.813: X1.SPRT@2 31.34,52.22 30.82,52.74 FB1.2
VIN  (4 unrouted)